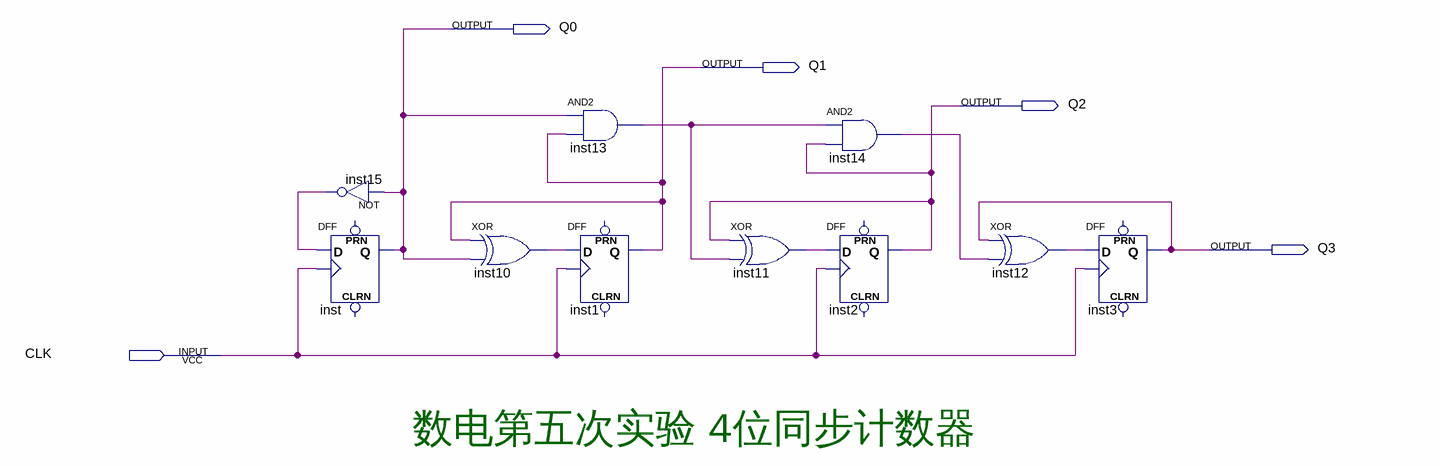
[diagram p0: schematic sheet]
// Quartus schematic 4bittbjsq.bdf as structural Verilog: 10 symbols, 5 pins
module \4bittbjsq  (
  input  CLK,
  output Q0,
  output Q1,
  output Q2,
  output Q3
);

  wire inst10_out, inst11_out, inst12_out, inst13_out, inst14_out, inst15_out;

  not inst15 (inst15_out, Q0);
  DFF inst (.CLK(CLK), .D(inst15_out), .Q(Q0));  // open: CLRN, PRN
  xor inst10 (inst10_out, Q1, Q0);
  and inst13 (inst13_out, Q0, Q1);
  DFF inst1 (.CLK(CLK), .D(inst10_out), .Q(Q1));  // open: CLRN, PRN
  xor inst11 (inst11_out, Q2, inst13_out);
  and inst14 (inst14_out, inst13_out, Q2);
  DFF inst2 (.CLK(CLK), .D(inst11_out), .Q(Q2));  // open: CLRN, PRN
  xor inst12 (inst12_out, Q3, inst14_out);
  DFF inst3 (.CLK(CLK), .D(inst12_out), .Q(Q3));  // open: CLRN, PRN

  // Notes on the sheet:
  //   数电第五次实验 4位同步计数器
endmodule
